# EAGLE design button interface board (EAGLE 5.02)
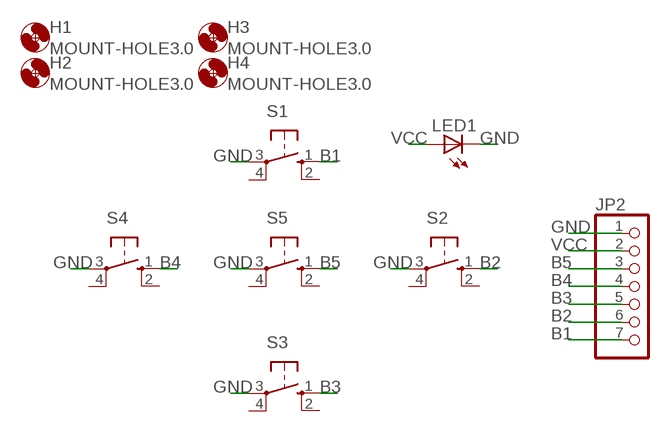
[diagram p0: schematic, sheet 1]

## Parts
H1  MOUNT-HOLE3.0  [3,0]
H2  MOUNT-HOLE3.0  [3,0]
H3  MOUNT-HOLE3.0  [3,0]
H4  MOUNT-HOLE3.0  [3,0]
JP2  PINHD-1X7  [1X07]
LED1  LED3MM  [LED3MM]
S1  10-XX  [B3F-10XX]
S2  10-XX  [B3F-10XX]
S3  10-XX  [B3F-10XX]
S4  10-XX  [B3F-10XX]
S5  10-XX  [B3F-10XX]

## Nets
B1: JP2.7 S1.1(S)
B2: JP2.6 S2.1(S)
B3: JP2.5 S3.1(S)
B4: JP2.4 S4.1(S)
B5: JP2.3 S5.1(S)
GND: JP2.1 LED1.K(C) S1.3(P) S2.3(P) S3.3(P) S4.3(P) S5.3(P)
VCC: JP2.2 LED1.A
Unconnected: S1.2(S1) S1.4(P1) S2.2(S1) S2.4(P1) S3.2(S1) S3.4(P1) S4.2(S1) S4.4(P1) S5.2(S1) S5.4(P1)

## Library data of the parts
H1-H4 = holes:MOUNT-HOLE: MOUNTING HOLE with drill center marker
JP2 = pinhead:PINHD-1X7: PIN HEADER
LED1 = led:LED: LED OSRAM: - CHIPLED LG R971, LG N971, LY N971, LG Q971, LY Q971, LO R971, LY R971 LH N974, LH R974 LS Q976, LO Q976, LY Q976 LO Q996 - Hyper CHIPLED LW Q18S LB Q993, LB Q99A, LB R99A - SideLED LS A670, LO A670, LY A670, LG A670, LP A670 LB A673, LV A673, LT A673, LW A673 LH A674 LY A675 LS A676, LA A676, LO A676, LY A676, LW A676 LS A679, LY A679, LG A679 - Hyper Micro SIDELED® LS Y876, LA Y876, LO Y876, LY Y876 LT Y87S - SmartLED LW L88C, LW L88S LB L89C, LB L89S, LG L890 LS L89K, LO L89K, LY L89K LS L896, LA L896, LO L896, LY L896 - TOPLED LS T670, LO T670, LY T670, LG T670, LP T670 LSG T670, LSP T670, LSY T670, LOP T670, LYG T670 LG T671, LOG T671, LSG T671 LB T673, LV T673, LT T673, LW T673 LH T674 LS T676, LA T676, LO T676, LY T676, LB T676, LH T676, LSB T676, LW T676 LB T67C, LV T67C, LT T67C, LS T67K, LO T67K, LY T67K, LW E67C LS E67B, LA E67B, LO E67B, LY E67B, LB E67C, LV E67C, LT E67C LW T67C LS T679, LY T679, LG T679 LS T770, LO T770, LY T770, LG T770, LP T770 LB T773, LV T773, LT T773, LW T773 LH T774 LS E675, LA E675, LY E675, LS T675 LS T776, LA T776, LO T776, LY T776, LB T776 LHGB T686 LT T68C, LB T68C - Hyper Mini TOPLED® LB M676 - Mini TOPLED Santana® LG M470 LS M47K, LO M47K, LY M47K Source: http://www.osram.convergy.de - LUMILED® LXK2-PW12-R00, LXK2-PW12-S00, LXK2-PW14-U00, LXK2-PW14-V00 LXK2-PM12-R00, LXK2-PM12-S00, LXK2-PM14-U00 LXK2-PE12-Q00, LXK2-PE12-R00, LXK2-PE12-S00, LXK2-PE14-T00, LXK2-PE14-U00 LXK2-PB12-K00, LXK2-PB12-L00, LXK2-PB12-M00, LXK2-PB14-N00, LXK2-PB14-P00, LXK2-PB14-Q00 LXK2-PR12-L00, LXK2-PR12-M00, LXK2-PR14-Q00, LXK2-PR14-R00 LXK2-PD12-Q00, LXK2-PD12-R00, LXK2-PD12-S00 LXK2-PH12-R00, LXK2-PH12-S00 LXK2-PL12-P00, LXK2-PL12-Q00, LXK2-PL12-R00 Source: www.luxeon.com
S1-S5 = switch-omron:10-XX: OMRON SWITCH

## Board
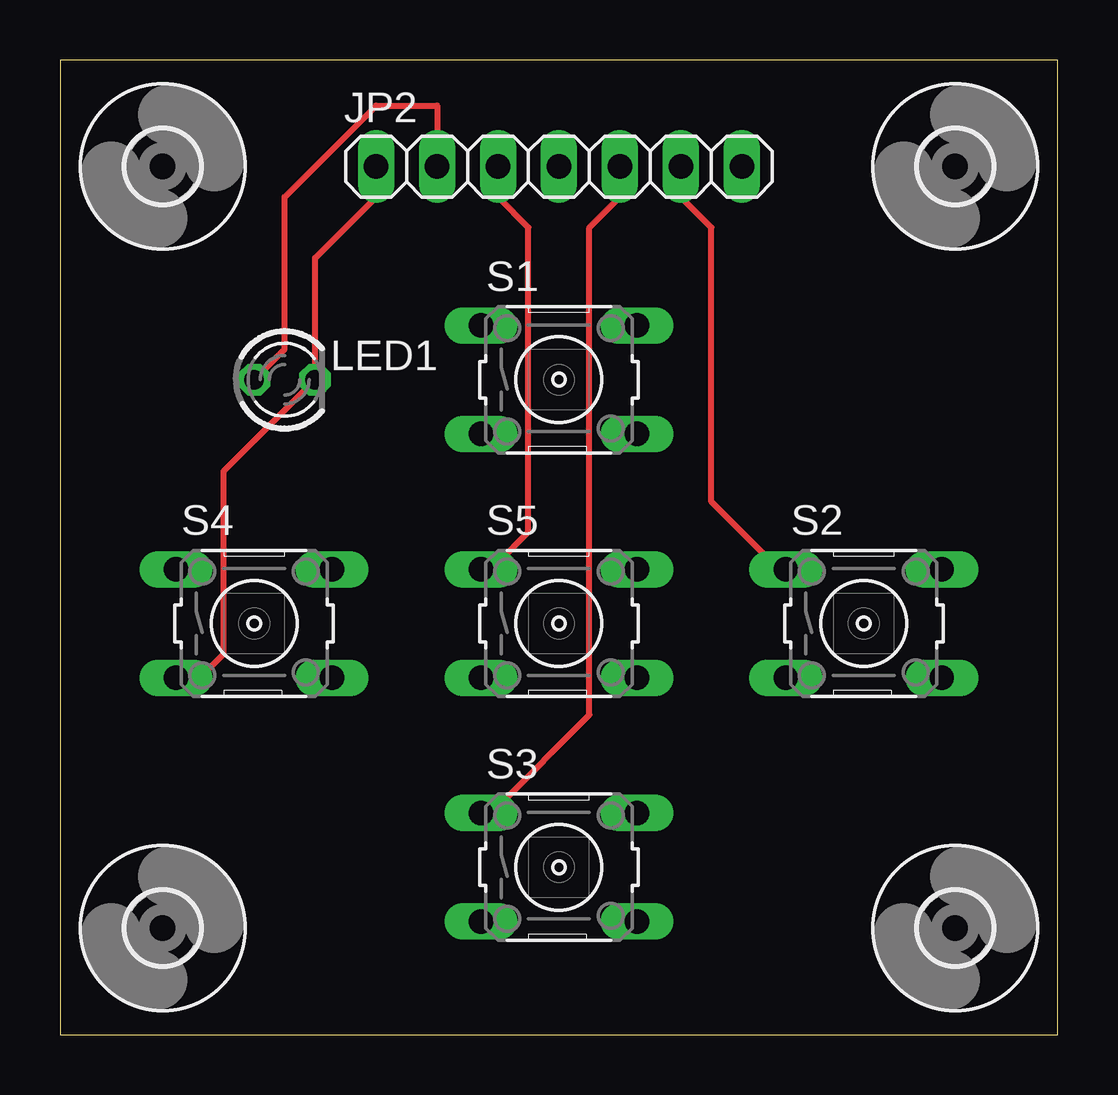
[diagram p1: board, top side]
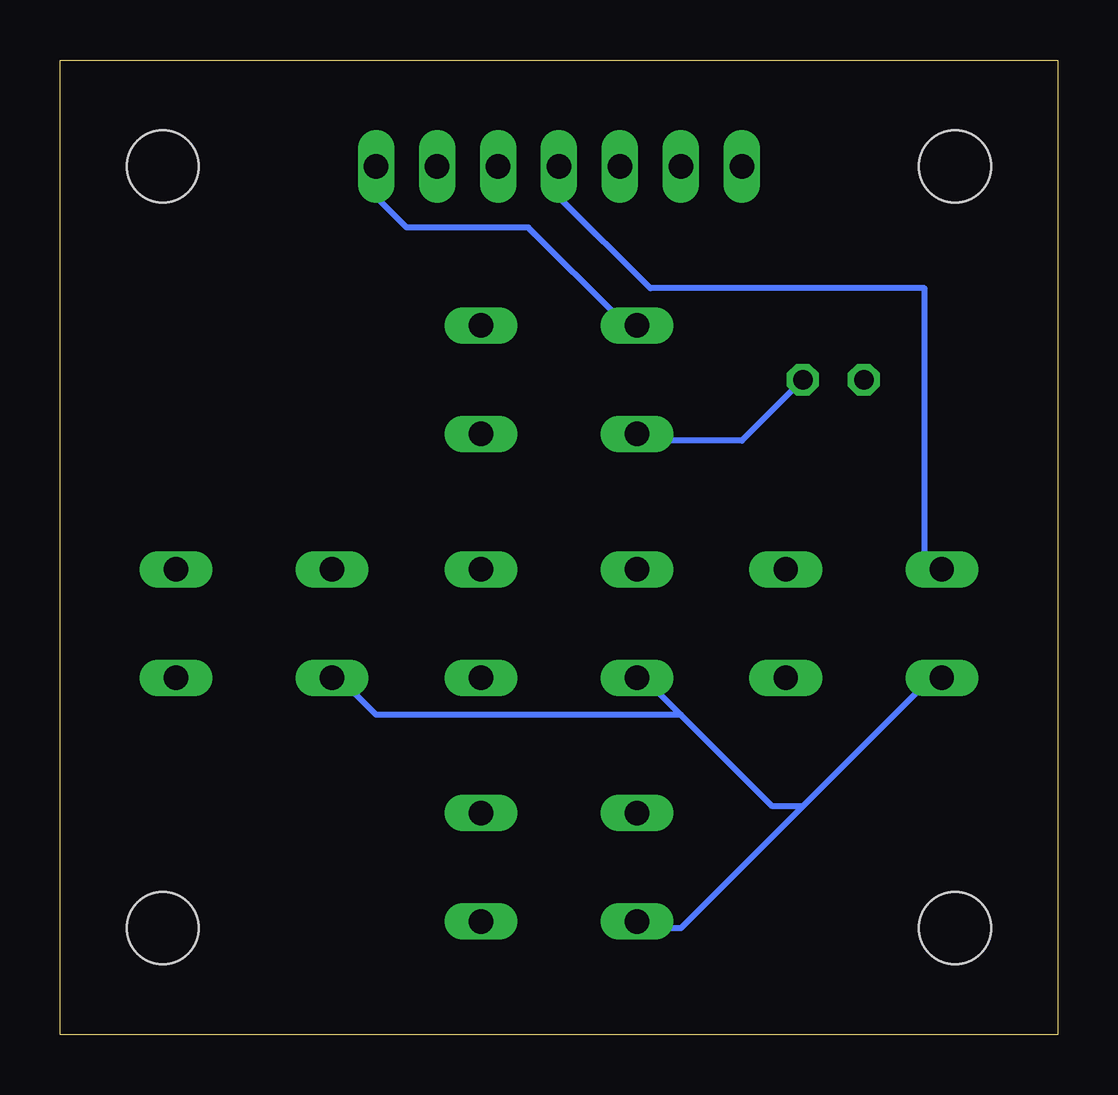
[diagram p2: board, bottom side, seen from below]

Size 41.58 x 40.63 mm. Coordinates in mm from the lower left corner, seen from the top.
Outline: 0,0 41.58,0 41.58,40.63 0,40.63 0,0
Copper layers (1*16): Top 0.035mm / dielectric 1.5mm / Bottom 0.035mm
Design rules "default": minimum track width 10mil, minimum drill 24mil, track to track 8mil, track to pad 8mil, pad to pad 8mil, via to via 8mil, smd to smd 8mil, copper to edge 40mil, drill to drill 8mil, minimum pad ring 10mil, minimum via ring 8mil, stop-mask expansion 4mil, vias tented up to drill 0mil, thermal gap 10mil

### Footprints (pad centres in the part's own frame; a part is rotated, then mirrored left to right if it is on the bottom)
3,0 = hole 3: 0,0
1X07 = drill 1.016 long: 1 -7.62,0; 2 -5.08,0; 3 -2.54,0; 4 0,0; 5 2.54,0; 6 5.08,0; 7 7.62,0
LED3MM = drill 0.813 octagon: A -1.27,0; K 1.27,0
B3F-10XX = drill 1.016 long: 1 -3.251,2.261; 2 3.251,2.261; 3 -3.251,-2.261; 4 3.251,-2.261

### Placement (x,y rotation side)
H1  37.3,4.44 0 top
H2  4.28,4.44 0 top
H3  4.28,36.19 0 top
H4  37.3,36.19 0 top
JP2  20.79,36.19 0 top
LED1  9.36,27.3 0 top
S1  20.79,27.3 0 top
S2  33.49,17.14 0 top
S3  20.79,6.98 0 top
S4  8.09,17.14 0 top
S5  20.79,17.14 0 top

### Tracks (layer width: path | path; a pad name or v marks a point on that pad's centre or on a via)
B1
  Bottom 0.254: S1.1 18.25,29.84 22.06,33.65 27.14,33.65 28.41,34.92 JP2.7
B2
  Top 0.254: S2.1 29.68,19.68 27.14,22.22 27.14,33.65 25.87,34.92 JP2.6
B3
  Top 0.254: S3.1 18.25,9.52 22.06,13.33 22.06,33.65 23.33,34.92 JP2.5
B4
  Bottom 0.254: S4.1 5.55,19.68 5.55,31.11 16.98,31.11 20.79,34.92 JP2.4
B5
  Top 0.254: S5.1 18.25,19.68 19.52,20.95 19.52,33.65 18.25,34.92 JP2.3
GND
  Top 0.254: JP2.1 13.17,34.92 10.63,32.38 LED1.K 6.82,23.49 6.82,15.87 5.55,14.6 S4.3
  Bottom 0.254: LED1.K 13.17,24.76 16.98,24.76 S1.3 | 10.63,9.52 15.71,4.44 16.98,4.44 S3.3 | 10.63,9.52 5.55,14.6 S4.3 | 15.71,13.33 11.9,9.52 10.63,9.52 | 15.71,13.33 16.98,14.6 S5.3 | 15.71,13.33 28.41,13.33 29.68,14.6 S2.3
VCC
  Top 0.254: LED1.A 9.36,28.57 9.36,34.92 13.17,38.73 15.71,38.73 JP2.2